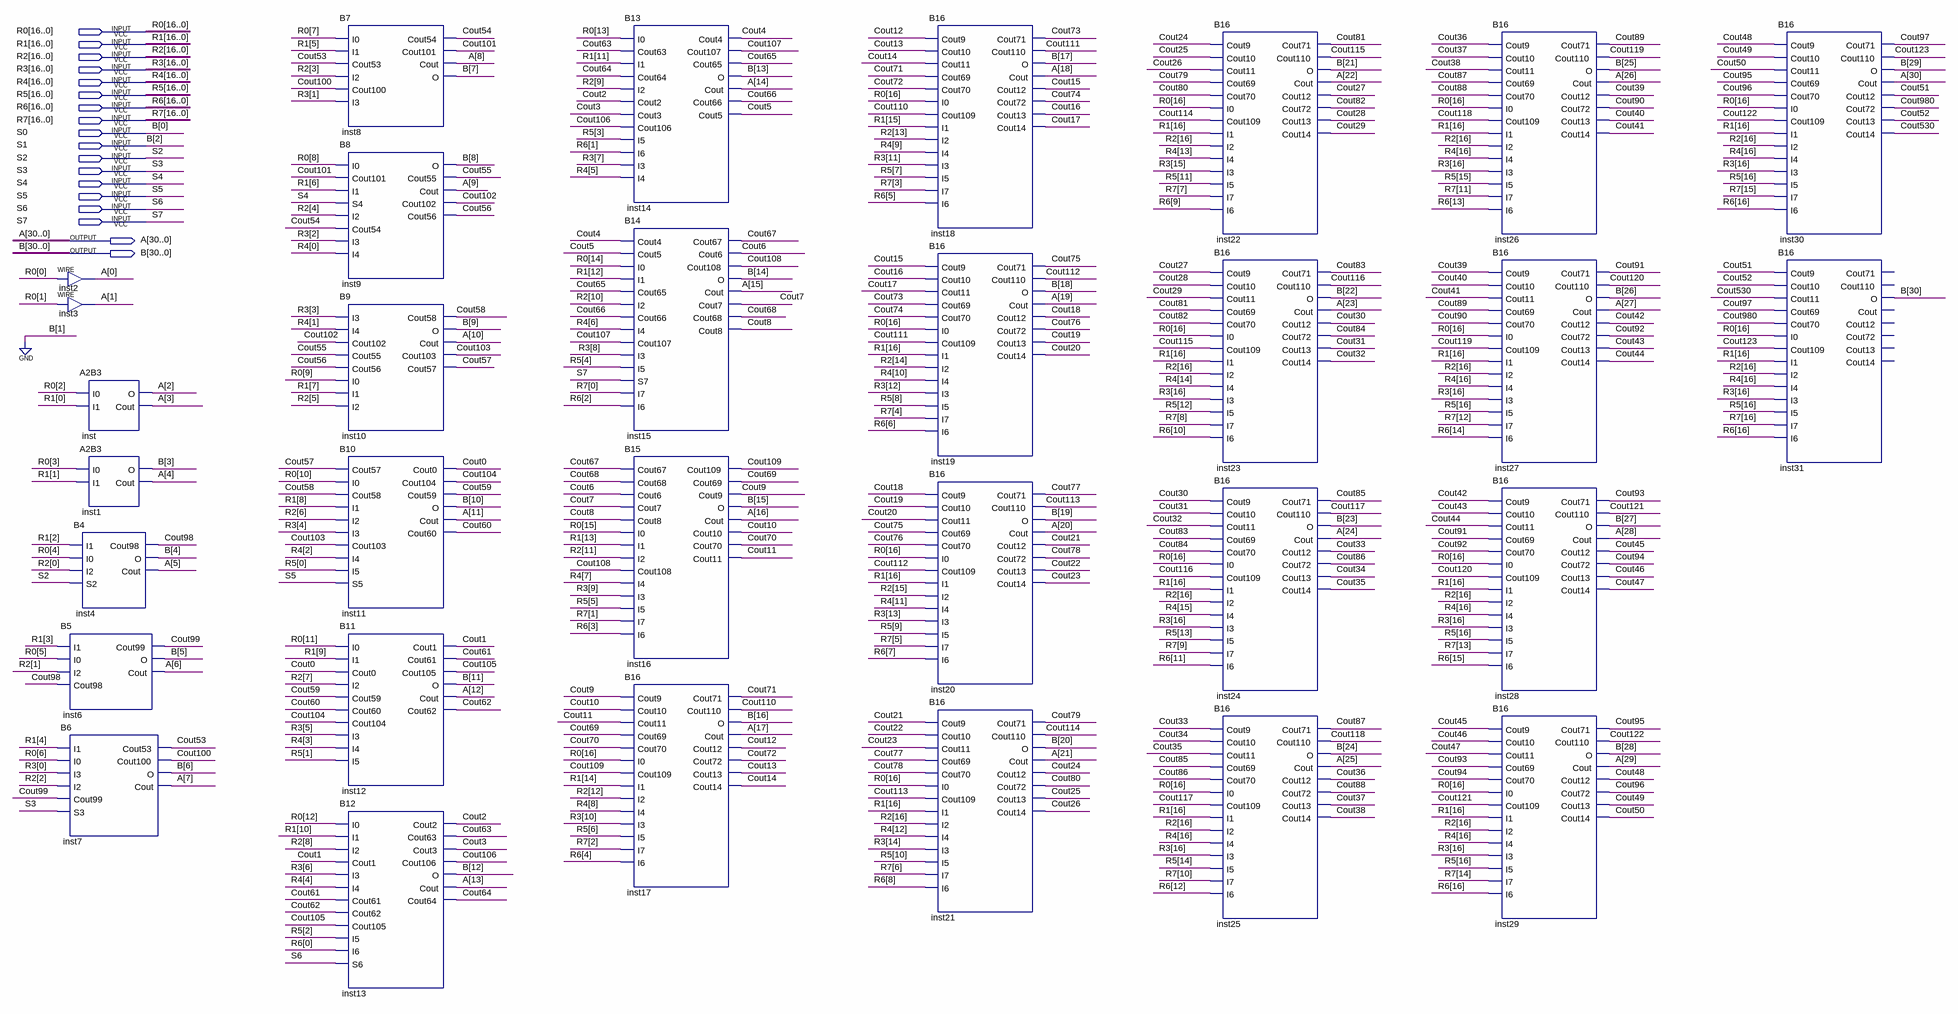
[diagram p0: schematic sheet]
// Quartus schematic DADDA8.bdf as structural Verilog: 31 symbols, 18 pins
module DADDA8 (
  input  [16:0] R0,
  input  [16:0] R1,
  input  [16:0] R2,
  input  [16:0] R3,
  input  [16:0] R4,
  input  [16:0] R5,
  input  [16:0] R6,
  input  [16:0] R7,
  input  S0,
  input  S1,
  input  S2,
  input  S3,
  input  S4,
  input  S5,
  input  S6,
  input  S7,
  output [30:0] A,
  output [30:0] B
);

  wire Cout0, Cout1, Cout2, Cout3, Cout4, Cout5, Cout6, Cout7, Cout8, Cout9, Cout10, Cout11, Cout12, Cout13,
       Cout14, Cout15, Cout16, Cout17, Cout18, Cout19, Cout20, Cout21, Cout22, Cout23, Cout24, Cout25,
       Cout26, Cout27, Cout28, Cout29, Cout30, Cout31, Cout32, Cout33, Cout34, Cout35, Cout36, Cout37,
       Cout38, Cout39, Cout40, Cout41, Cout42, Cout43, Cout44, Cout45, Cout46, Cout47, Cout48, Cout49,
       Cout50, Cout51, Cout52, Cout53, Cout54, Cout55, Cout56, Cout57, Cout58, Cout59, Cout60, Cout61,
       Cout62, Cout63, Cout64, Cout65, Cout66, Cout67, Cout68, Cout69, Cout70, Cout71, Cout72, Cout73,
       Cout74, Cout75, Cout76, Cout77, Cout78, Cout79, Cout80, Cout81, Cout82, Cout83, Cout84, Cout85,
       Cout86, Cout87, Cout88, Cout89, Cout90, Cout91, Cout92, Cout93, Cout94, Cout95, Cout96, Cout97,
       Cout98, Cout99, Cout100, Cout101, Cout102, Cout103, Cout104, Cout105, Cout106, Cout107, Cout108,
       Cout109, Cout110, Cout111, Cout112, Cout113, Cout114, Cout115, Cout116, Cout117, Cout118, Cout119,
       Cout120, Cout121, Cout122, Cout123, Cout530, Cout980;

  assign A[0] = R0[0];  // WIRE inst2
  assign A[1] = R0[1];  // WIRE inst3
  A2B3 inst (.I0(R0[2]), .I1(R1[0]), .O(A[2]), .Cout(A[3]));
  A2B3 inst1 (.I0(R0[3]), .I1(R1[1]), .O(B[3]), .Cout(A[4]));
  B4 inst4 (.I1(R1[2]), .I0(R0[4]), .I2(R2[0]), .S2(S2), .Cout98(Cout98), .O(B[4]), .Cout(A[5]));
  B5 inst6 (.I1(R1[3]), .I0(R0[5]), .I2(R2[1]), .Cout98(Cout98), .Cout99(Cout99), .O(B[5]), .Cout(A[6]));
  B6 inst7 (
    .I1(R1[4]), .I0(R0[6]), .I3(R3[0]), .I2(R2[2]), .Cout99(Cout99), .S3(S3), .Cout53(Cout53),
    .Cout100(Cout100), .O(B[6]), .Cout(A[7]));
  B7 inst8 (
    .I0(R0[7]), .I1(R1[5]), .Cout53(Cout53), .I2(R2[3]), .Cout100(Cout100), .I3(R3[1]), .Cout54(Cout54),
    .Cout101(Cout101), .Cout(A[8]), .O(B[7]));
  B8 inst9 (
    .I0(R0[8]), .Cout101(Cout101), .I1(R1[6]), .S4(S4), .I2(R2[4]), .Cout54(Cout54), .I3(R3[2]), .I4(R4[0]),
    .O(B[8]), .Cout55(Cout55), .Cout(A[9]), .Cout102(Cout102), .Cout56(Cout56));
  B9 inst10 (
    .I3(R3[3]), .I4(R4[1]), .Cout102(Cout102), .Cout55(Cout55), .Cout56(Cout56), .I0(R0[9]), .I1(R1[7]),
    .I2(R2[5]), .Cout58(Cout58), .O(B[9]), .Cout(A[10]), .Cout103(Cout103), .Cout57(Cout57));
  B10 inst11 (
    .Cout57(Cout57), .I0(R0[10]), .Cout58(Cout58), .I1(R1[8]), .I2(R2[6]), .I3(R3[4]), .Cout103(Cout103),
    .I4(R4[2]), .I5(R5[0]), .S5(S5), .Cout0(Cout0), .Cout104(Cout104), .Cout59(Cout59), .O(B[10]),
    .Cout(A[11]), .Cout60(Cout60));
  B11 inst12 (
    .I0(R0[11]), .I1(R1[9]), .Cout0(Cout0), .I2(R2[7]), .Cout59(Cout59), .Cout60(Cout60), .Cout104(Cout104),
    .I3(R3[5]), .I4(R4[3]), .I5(R5[1]), .Cout1(Cout1), .Cout61(Cout61), .Cout105(Cout105), .O(B[11]),
    .Cout(A[12]), .Cout62(Cout62));
  B12 inst13 (
    .I0(R0[12]), .I1(R1[10]), .I2(R2[8]), .Cout1(Cout1), .I3(R3[6]), .I4(R4[4]), .Cout61(Cout61),
    .Cout62(Cout62), .Cout105(Cout105), .I5(R5[2]), .I6(R6[0]), .S6(S6), .Cout2(Cout2), .Cout63(Cout63),
    .Cout3(Cout3), .Cout106(Cout106), .O(B[12]), .Cout(A[13]), .Cout64(Cout64));
  B13 inst14 (
    .I0(R0[13]), .Cout63(Cout63), .I1(R1[11]), .Cout64(Cout64), .I2(R2[9]), .Cout2(Cout2), .Cout3(Cout3),
    .Cout106(Cout106), .I5(R5[3]), .I6(R6[1]), .I3(R3[7]), .I4(R4[5]), .Cout4(Cout4), .Cout107(Cout107),
    .Cout65(Cout65), .O(B[13]), .Cout(A[14]), .Cout66(Cout66), .Cout5(Cout5));
  B14 inst15 (
    .Cout4(Cout4), .Cout5(Cout5), .I0(R0[14]), .I1(R1[12]), .Cout65(Cout65), .I2(R2[10]), .Cout66(Cout66),
    .I4(R4[6]), .Cout107(Cout107), .I3(R3[8]), .I5(R5[4]), .S7(S7), .I7(R7[0]), .I6(R6[2]), .Cout67(Cout67),
    .Cout6(Cout6), .Cout108(Cout108), .O(B[14]), .Cout(A[15]), .Cout7(Cout7), .Cout68(Cout68), .Cout8(Cout8));
  B15 inst16 (
    .Cout67(Cout67), .Cout68(Cout68), .Cout6(Cout6), .Cout7(Cout7), .Cout8(Cout8), .I0(R0[15]), .I1(R1[13]),
    .I2(R2[11]), .Cout108(Cout108), .I4(R4[7]), .I3(R3[9]), .I5(R5[5]), .I7(R7[1]), .I6(R6[3]),
    .Cout109(Cout109), .Cout69(Cout69), .Cout9(Cout9), .O(B[15]), .Cout(A[16]), .Cout10(Cout10),
    .Cout70(Cout70), .Cout11(Cout11));
  B16 inst17 (
    .Cout9(Cout9), .Cout10(Cout10), .Cout11(Cout11), .Cout69(Cout69), .Cout70(Cout70), .I0(R0[16]),
    .Cout109(Cout109), .I1(R1[14]), .I2(R2[12]), .I4(R4[8]), .I3(R3[10]), .I5(R5[6]), .I7(R7[2]), .I6(R6[4]),
    .Cout71(Cout71), .Cout110(Cout110), .O(B[16]), .Cout(A[17]), .Cout12(Cout12), .Cout72(Cout72),
    .Cout13(Cout13), .Cout14(Cout14));
  B16 inst18 (
    .Cout9(Cout12), .Cout10(Cout13), .Cout11(Cout14), .Cout69(Cout71), .Cout70(Cout72), .I0(R0[16]),
    .Cout109(Cout110), .I1(R1[15]), .I2(R2[13]), .I4(R4[9]), .I3(R3[11]), .I5(R5[7]), .I7(R7[3]), .I6(R6[5]),
    .Cout71(Cout73), .Cout110(Cout111), .O(B[17]), .Cout(A[18]), .Cout12(Cout15), .Cout72(Cout74),
    .Cout13(Cout16), .Cout14(Cout17));
  B16 inst19 (
    .Cout9(Cout15), .Cout10(Cout16), .Cout11(Cout17), .Cout69(Cout73), .Cout70(Cout74), .I0(R0[16]),
    .Cout109(Cout111), .I1(R1[16]), .I2(R2[14]), .I4(R4[10]), .I3(R3[12]), .I5(R5[8]), .I7(R7[4]),
    .I6(R6[6]), .Cout71(Cout75), .Cout110(Cout112), .O(B[18]), .Cout(A[19]), .Cout12(Cout18),
    .Cout72(Cout76), .Cout13(Cout19), .Cout14(Cout20));
  B16 inst20 (
    .Cout9(Cout18), .Cout10(Cout19), .Cout11(Cout20), .Cout69(Cout75), .Cout70(Cout76), .I0(R0[16]),
    .Cout109(Cout112), .I1(R1[16]), .I2(R2[15]), .I4(R4[11]), .I3(R3[13]), .I5(R5[9]), .I7(R7[5]),
    .I6(R6[7]), .Cout71(Cout77), .Cout110(Cout113), .O(B[19]), .Cout(A[20]), .Cout12(Cout21),
    .Cout72(Cout78), .Cout13(Cout22), .Cout14(Cout23));
  B16 inst21 (
    .Cout9(Cout21), .Cout10(Cout22), .Cout11(Cout23), .Cout69(Cout77), .Cout70(Cout78), .I0(R0[16]),
    .Cout109(Cout113), .I1(R1[16]), .I2(R2[16]), .I4(R4[12]), .I3(R3[14]), .I5(R5[10]), .I7(R7[6]),
    .I6(R6[8]), .Cout71(Cout79), .Cout110(Cout114), .O(B[20]), .Cout(A[21]), .Cout12(Cout24),
    .Cout72(Cout80), .Cout13(Cout25), .Cout14(Cout26));
  B16 inst22 (
    .Cout9(Cout24), .Cout10(Cout25), .Cout11(Cout26), .Cout69(Cout79), .Cout70(Cout80), .I0(R0[16]),
    .Cout109(Cout114), .I1(R1[16]), .I2(R2[16]), .I4(R4[13]), .I3(R3[15]), .I5(R5[11]), .I7(R7[7]),
    .I6(R6[9]), .Cout71(Cout81), .Cout110(Cout115), .O(B[21]), .Cout(A[22]), .Cout12(Cout27),
    .Cout72(Cout82), .Cout13(Cout28), .Cout14(Cout29));
  B16 inst23 (
    .Cout9(Cout27), .Cout10(Cout28), .Cout11(Cout29), .Cout69(Cout81), .Cout70(Cout82), .I0(R0[16]),
    .Cout109(Cout115), .I1(R1[16]), .I2(R2[16]), .I4(R4[14]), .I3(R3[16]), .I5(R5[12]), .I7(R7[8]),
    .I6(R6[10]), .Cout71(Cout83), .Cout110(Cout116), .O(B[22]), .Cout(A[23]), .Cout12(Cout30),
    .Cout72(Cout84), .Cout13(Cout31), .Cout14(Cout32));
  B16 inst24 (
    .Cout9(Cout30), .Cout10(Cout31), .Cout11(Cout32), .Cout69(Cout83), .Cout70(Cout84), .I0(R0[16]),
    .Cout109(Cout116), .I1(R1[16]), .I2(R2[16]), .I4(R4[15]), .I3(R3[16]), .I5(R5[13]), .I7(R7[9]),
    .I6(R6[11]), .Cout71(Cout85), .Cout110(Cout117), .O(B[23]), .Cout(A[24]), .Cout12(Cout33),
    .Cout72(Cout86), .Cout13(Cout34), .Cout14(Cout35));
  B16 inst25 (
    .Cout9(Cout33), .Cout10(Cout34), .Cout11(Cout35), .Cout69(Cout85), .Cout70(Cout86), .I0(R0[16]),
    .Cout109(Cout117), .I1(R1[16]), .I2(R2[16]), .I4(R4[16]), .I3(R3[16]), .I5(R5[14]), .I7(R7[10]),
    .I6(R6[12]), .Cout71(Cout87), .Cout110(Cout118), .O(B[24]), .Cout(A[25]), .Cout12(Cout36),
    .Cout72(Cout88), .Cout13(Cout37), .Cout14(Cout38));
  B16 inst26 (
    .Cout9(Cout36), .Cout10(Cout37), .Cout11(Cout38), .Cout69(Cout87), .Cout70(Cout88), .I0(R0[16]),
    .Cout109(Cout118), .I1(R1[16]), .I2(R2[16]), .I4(R4[16]), .I3(R3[16]), .I5(R5[15]), .I7(R7[11]),
    .I6(R6[13]), .Cout71(Cout89), .Cout110(Cout119), .O(B[25]), .Cout(A[26]), .Cout12(Cout39),
    .Cout72(Cout90), .Cout13(Cout40), .Cout14(Cout41));
  B16 inst27 (
    .Cout9(Cout39), .Cout10(Cout40), .Cout11(Cout41), .Cout69(Cout89), .Cout70(Cout90), .I0(R0[16]),
    .Cout109(Cout119), .I1(R1[16]), .I2(R2[16]), .I4(R4[16]), .I3(R3[16]), .I5(R5[16]), .I7(R7[12]),
    .I6(R6[14]), .Cout71(Cout91), .Cout110(Cout120), .O(B[26]), .Cout(A[27]), .Cout12(Cout42),
    .Cout72(Cout92), .Cout13(Cout43), .Cout14(Cout44));
  B16 inst28 (
    .Cout9(Cout42), .Cout10(Cout43), .Cout11(Cout44), .Cout69(Cout91), .Cout70(Cout92), .I0(R0[16]),
    .Cout109(Cout120), .I1(R1[16]), .I2(R2[16]), .I4(R4[16]), .I3(R3[16]), .I5(R5[16]), .I7(R7[13]),
    .I6(R6[15]), .Cout71(Cout93), .Cout110(Cout121), .O(B[27]), .Cout(A[28]), .Cout12(Cout45),
    .Cout72(Cout94), .Cout13(Cout46), .Cout14(Cout47));
  B16 inst29 (
    .Cout9(Cout45), .Cout10(Cout46), .Cout11(Cout47), .Cout69(Cout93), .Cout70(Cout94), .I0(R0[16]),
    .Cout109(Cout121), .I1(R1[16]), .I2(R2[16]), .I4(R4[16]), .I3(R3[16]), .I5(R5[16]), .I7(R7[14]),
    .I6(R6[16]), .Cout71(Cout95), .Cout110(Cout122), .O(B[28]), .Cout(A[29]), .Cout12(Cout48),
    .Cout72(Cout96), .Cout13(Cout49), .Cout14(Cout50));
  B16 inst30 (
    .Cout9(Cout48), .Cout10(Cout49), .Cout11(Cout50), .Cout69(Cout95), .Cout70(Cout96), .I0(R0[16]),
    .Cout109(Cout122), .I1(R1[16]), .I2(R2[16]), .I4(R4[16]), .I3(R3[16]), .I5(R5[16]), .I7(R7[15]),
    .I6(R6[16]), .Cout71(Cout97), .Cout110(Cout123), .O(B[29]), .Cout(A[30]), .Cout12(Cout51),
    .Cout72(Cout980), .Cout13(Cout52), .Cout14(Cout530));
  B16 inst31 (
    .Cout9(Cout51), .Cout10(Cout52), .Cout11(Cout530), .Cout69(Cout97), .Cout70(Cout980), .I0(R0[16]),
    .Cout109(Cout123), .I1(R1[16]), .I2(R2[16]), .I4(R4[16]), .I3(R3[16]), .I5(R5[16]), .I7(R7[16]),
    .I6(R6[16]), .O(B[30]));  // open: Cout71, Cout110, Cout, Cout12, Cout72, Cout13, Cout14

  assign B[2:0] = {S1, 1'b0, S0};
endmodule
